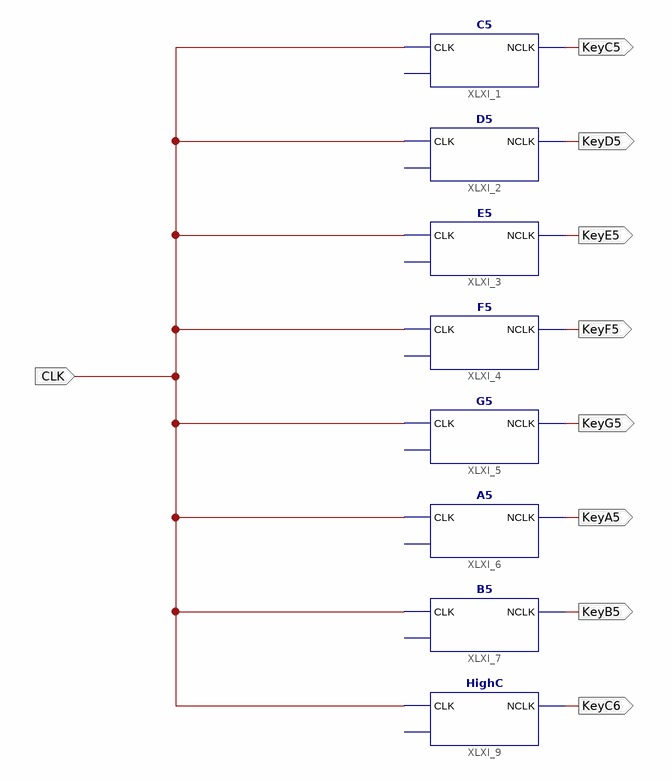
[diagram p0: schematic sheet 1]
// Xilinx ISE schematic HighOctaveKeys.sch (spartan6) as structural Verilog: 8 symbols, 9 ports
module HighOctaveKeys (
  input  CLK,
  output KeyC5,
  output KeyD5,
  output KeyE5,
  output KeyF5,
  output KeyG5,
  output KeyA5,
  output KeyB5,
  output KeyC6
);

  C5 XLXI_1 (.CLK(CLK), .NCLK(KeyC5));  // open: reset
  D5 XLXI_2 (.CLK(CLK), .NCLK(KeyD5));  // open: reset
  E5 XLXI_3 (.CLK(CLK), .NCLK(KeyE5));  // open: reset
  F5 XLXI_4 (.CLK(CLK), .NCLK(KeyF5));  // open: reset
  G5 XLXI_5 (.CLK(CLK), .NCLK(KeyG5));  // open: reset
  A5 XLXI_6 (.CLK(CLK), .NCLK(KeyA5));  // open: reset
  B5 XLXI_7 (.CLK(CLK), .NCLK(KeyB5));  // open: reset
  HighC XLXI_9 (.CLK(CLK), .NCLK(KeyC6));  // open: reset
endmodule
